# EasyEDA schematic ESP8266 STANDLONE_2021-05-12.json
TITLE: Sheet_1; REV: 1.0; Date: 2021-05-09; Sheet: 1/1; Drawn By: Sreeram AJ; Company: Your Company
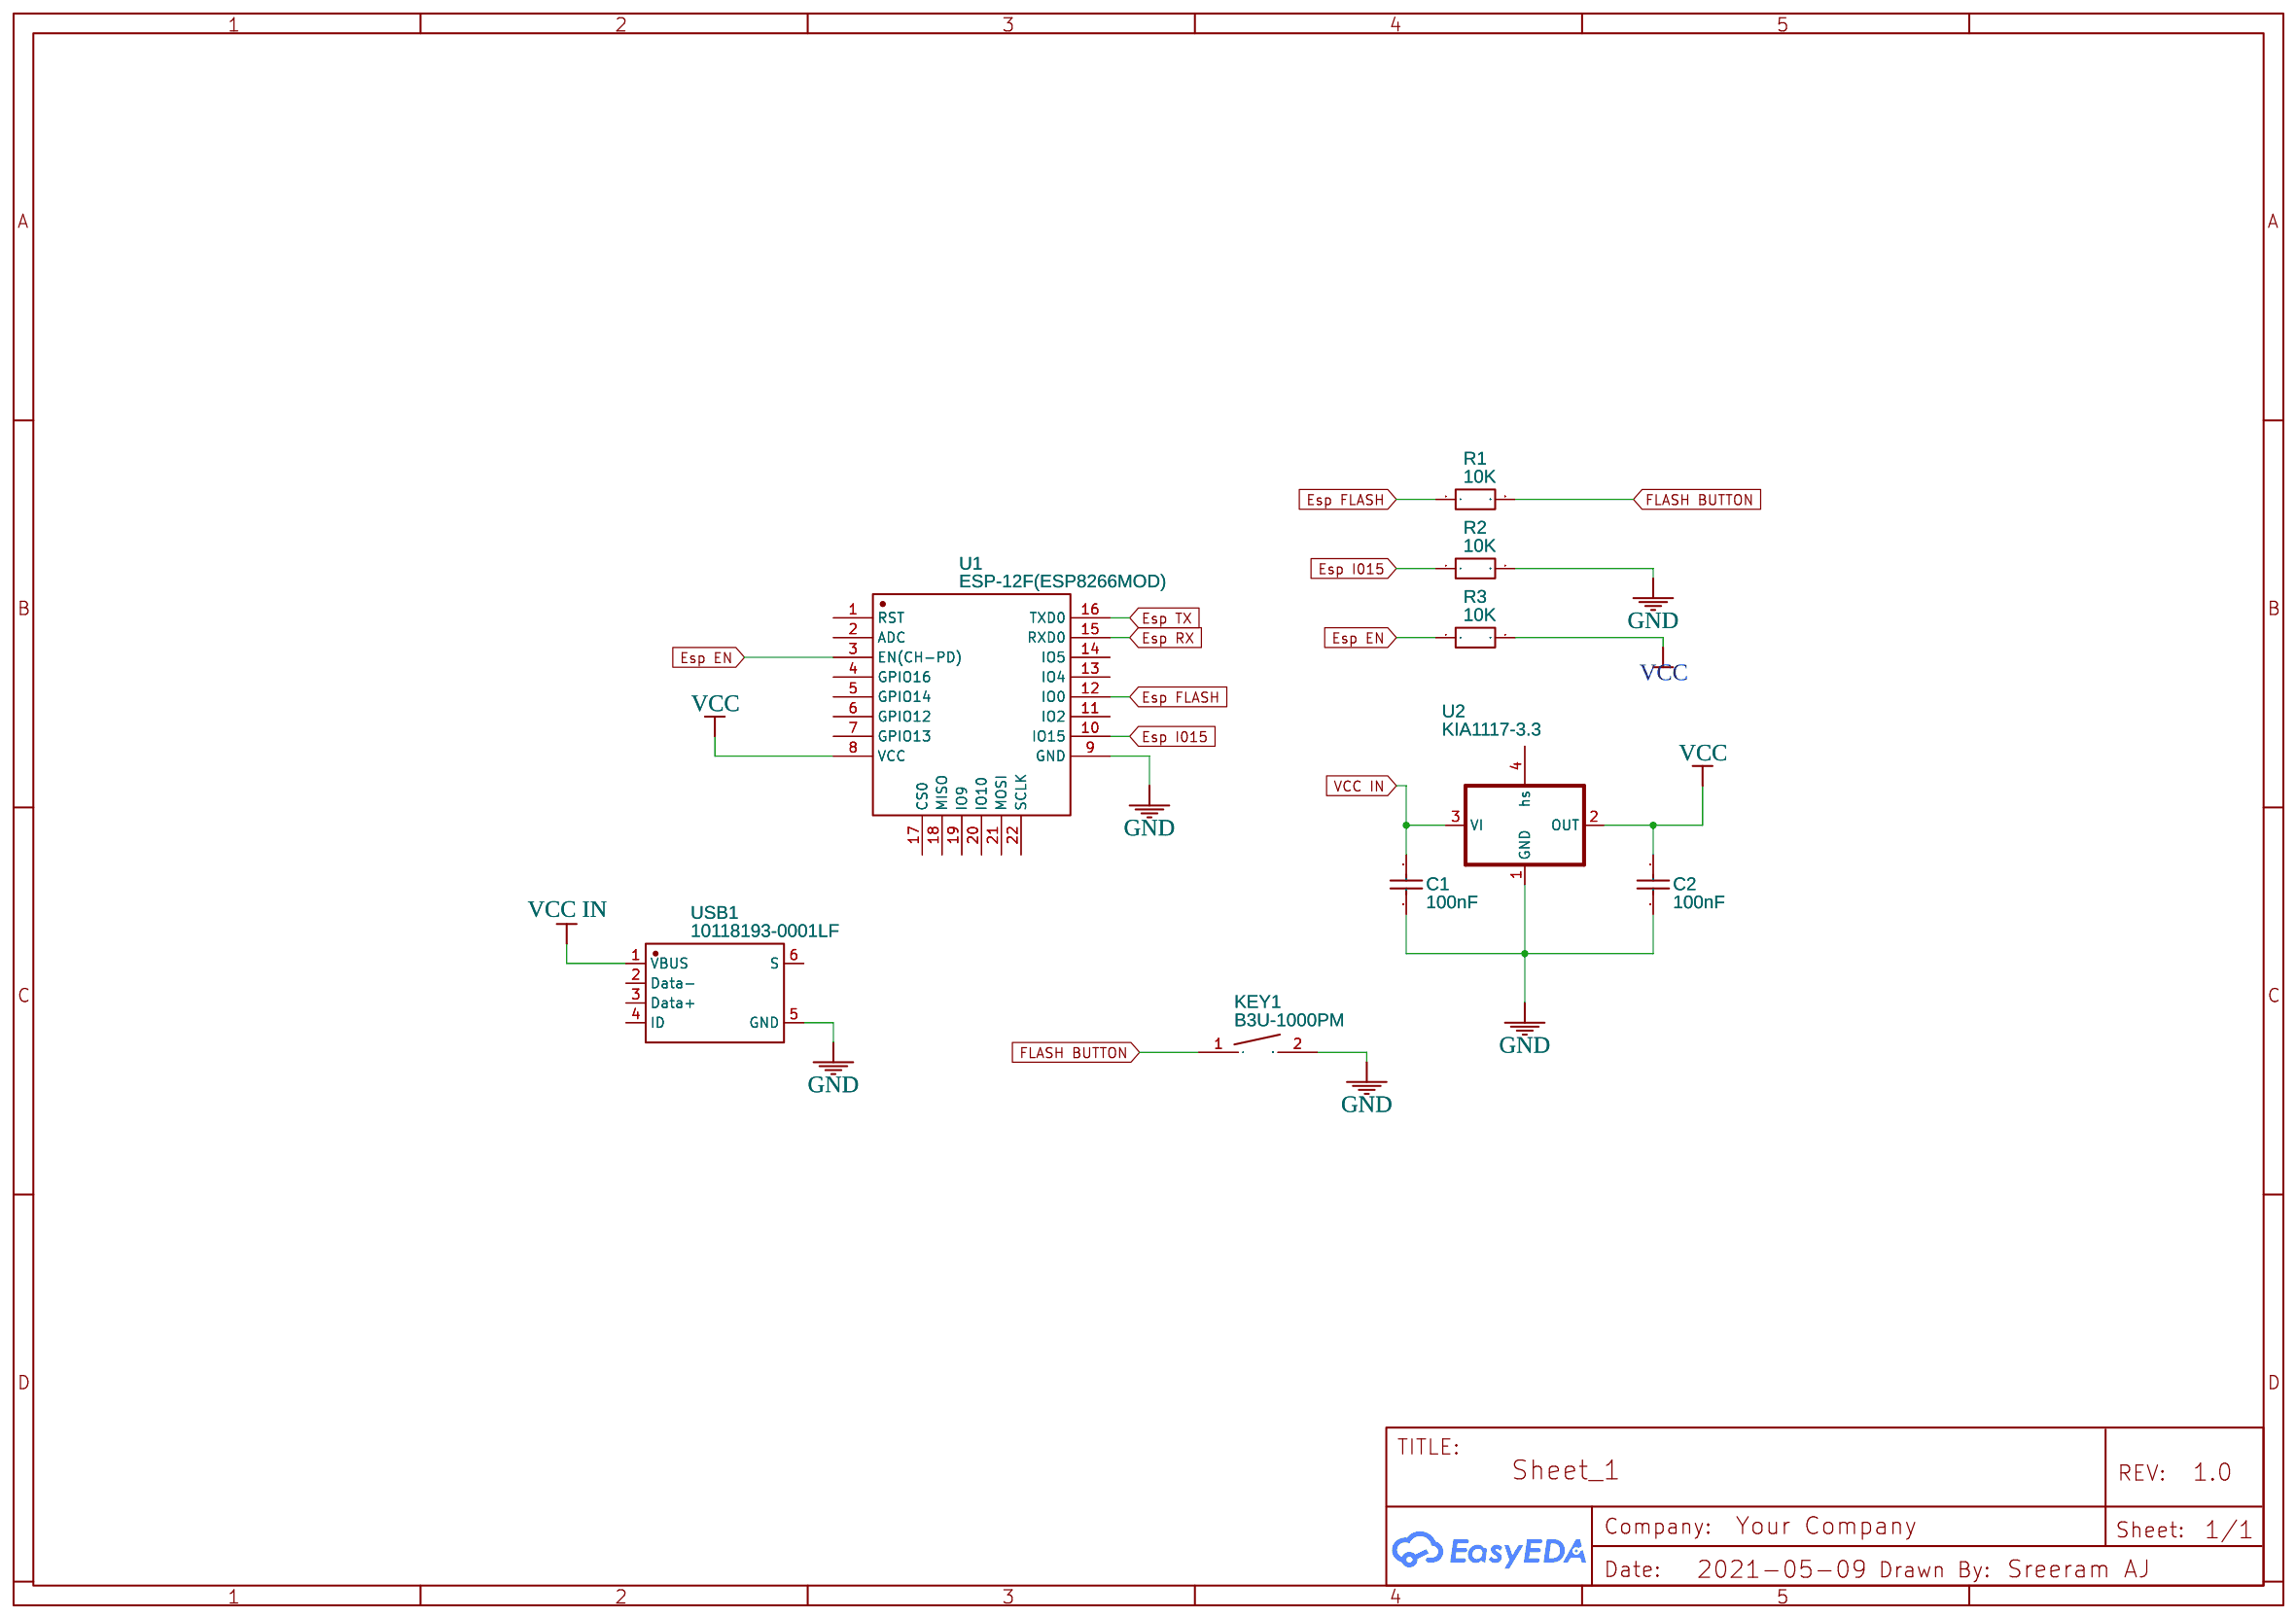
[diagram p0: schematic sheet]

## Parts
C1  100nF  [0603 CAPACITOR SMD]
C2  100nF  [0603 CAPACITOR SMD]
KEY1  B3U-1000PM  [KEY-SMD_B3U-1000PM]
R1  10K  [RESISTOR(0603)]
R2  10K  [RESISTOR(0603)]
R3  10K  [RESISTOR(0603)]
U1  ESP-12F(ESP8266MOD)  [WIFIM-SMD_ESP-12F-ESP8266MOD]
U2  KIA1117-3.3  [SOT-223]
USB1  10118193-0001LF  [MICRO-USB-SMD_10118193-0001LF]

## Library data of the parts
C1 C2 = 100nF: Supplier: LCSC; Manufacturer: LCSC; Manufacturer Part: 0.1UF(104) +-20% 63v; Supplier Part: C19355
KEY1 = B3U-1000PM: Supplier: LCSC; Supplier Part: C271754; Manufacturer: Omron Electronics; Contributor: LCSC
R1-R3 = RN 3WS 10K F T/B A1: Supplier: LCSC; Supplier Part: C433569; Manufacturer: TyoHM; Contributor: LCSC; JLCPCB Part Class: Extended Part
U1 = ESP-12F(ESP8266MOD): Supplier: LCSC; Manufacturer: Ai-Thinker; Supplier Part: C82891; JLCPCB Part Class: Extended Part
U2 = KIA1117-3.3: Supplier: LCSC; Manufacturer: KIA; Contributor: tonilopezortiz78; Supplier Part: C116069
USB1 = 10118193-0001LF: Supplier: LCSC; Supplier Part: C132562; Manufacturer: Amphenol ICC; Contributor: LCSC

## Nets
GND: C1.1 C2.1 KEY1.2 R2.2 U1.9(GND) U2.1(GND) USB1.5(GND)
VCC: C2.2 R3.2 U1.8(VCC) U2.2(OUT)
VCC IN: C1.2 U2.3(VI) USB1.1(VBUS)
Esp EN: R3.1 U1.3(EN(CH-PD))
Esp FLASH: R1.1 U1.12(IO0)
Esp I015: R2.1 U1.10(IO15)
Esp RX: U1.15(RXD0)
Esp TX: U1.16(TXD0)
FLASH BUTTON: KEY1.1 R1.2

Not connected (* = marked no-connect by the designer): U1 1(RST) 2(ADC) 4(GPIO16) 5(GPIO14) 6(GPIO12) 7(GPIO13) 11(IO2) 13(IO4) 14(IO5) 17(CS0) 18(MISO) 19(IO9) 20(IO10) 21(MOSI) 22(SCLK); U2 4(hs); USB1 2(Data-) 3(Data+) 4(ID) 6(S)
